# Altium schematic sheet FrameWork.SchDoc: FrameWork.SchDoc
size A3; Author: flotox@yeah.net; Revision: v1.0.0; SheetNumber: 1; SheetTotal: 10
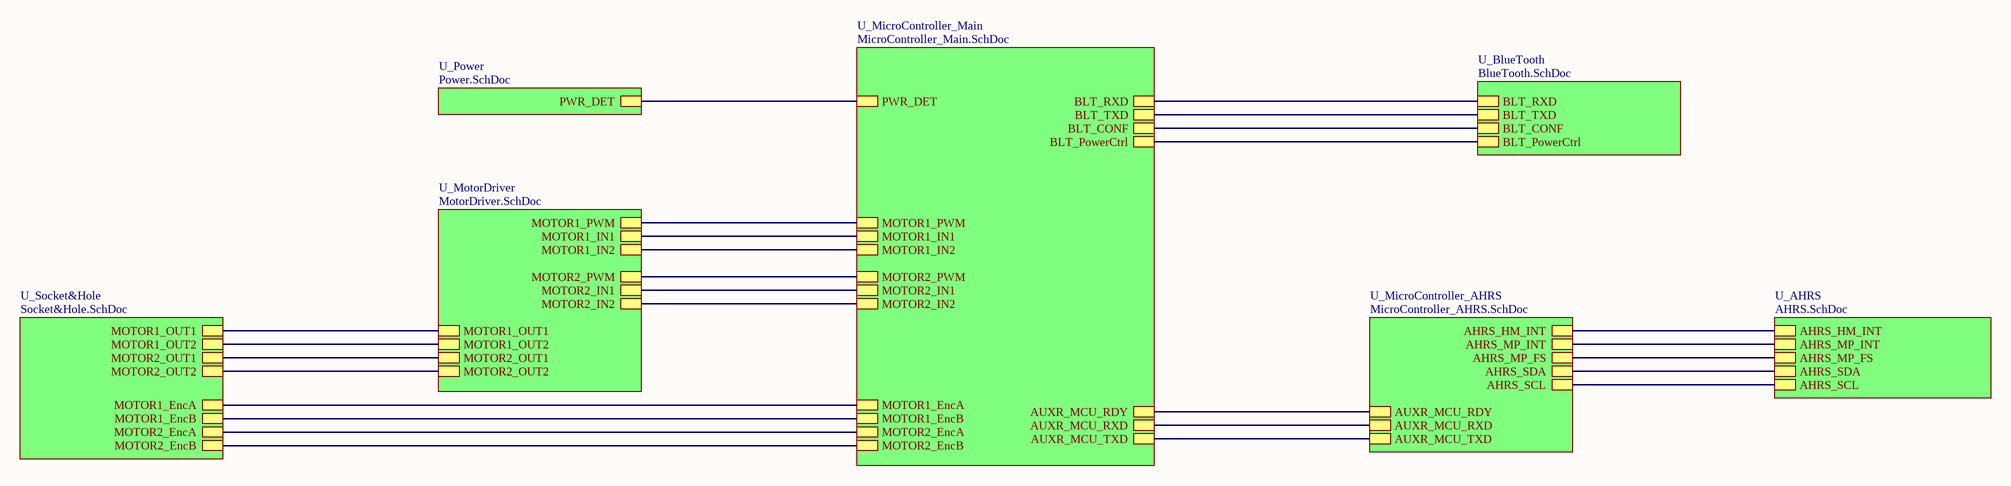
[diagram p0: FrameWork.SchDoc]

## Sub-sheets
U_AHRS = AHRS.SchDoc: AHRS_MP_INT, AHRS_SCL, AHRS_SDA, AHRS_MP_FS, AHRS_HM_INT
U_BlueTooth = BlueTooth.SchDoc: BLT_RXD, BLT_TXD, BLT_CONF, BLT_PowerCtrl
U_MicroController_AHRS = MicroController_AHRS.SchDoc: AUXR_MCU_RDY, AUXR_MCU_TXD, AUXR_MCU_RXD, AHRS_SCL, AHRS_SDA, AHRS_HM_INT, AHRS_MP_INT, AHRS_MP_FS
U_MicroController_Main = MicroController_Main.SchDoc: BLT_RXD, BLT_TXD, BLT_CONF, BLT_PowerCtrl, AUXR_MCU_TXD, AUXR_MCU_RXD, AUXR_MCU_RDY, PWR_DET, MOTOR1_PWM, MOTOR1_IN2, MOTOR1_IN1, MOTOR2_IN1, MOTOR2_IN2, MOTOR2_PWM, MOTOR1_EncA, MOTOR1_EncB, MOTOR2_EncA, MOTOR2_EncB
U_MotorDriver = MotorDriver.SchDoc: MOTOR1_OUT1, MOTOR1_OUT2, MOTOR2_OUT1, MOTOR2_OUT2, MOTOR1_PWM, MOTOR2_PWM, MOTOR1_IN1, MOTOR1_IN2, MOTOR2_IN1, MOTOR2_IN2
U_Power = Power.SchDoc: PWR_DET
U_Socket&Hole = Socket&Hole.SchDoc: MOTOR1_EncA, MOTOR1_EncB, MOTOR2_EncA, MOTOR2_EncB, MOTOR1_OUT1, MOTOR1_OUT2, MOTOR2_OUT1, MOTOR2_OUT2

## Nets
(unnamed): sheet U_MicroController_Main/BLT_RXD, sheet U_BlueTooth/BLT_RXD
(unnamed): sheet U_MicroController_Main/BLT_TXD, sheet U_BlueTooth/BLT_TXD
(unnamed): sheet U_MicroController_Main/BLT_CONF, sheet U_BlueTooth/BLT_CONF
(unnamed): sheet U_MicroController_Main/BLT_PowerCtrl, sheet U_BlueTooth/BLT_PowerCtrl
(unnamed): sheet U_MicroController_Main/AUXR_MCU_TXD, sheet U_MicroController_AHRS/AUXR_MCU_TXD
(unnamed): sheet U_MicroController_Main/AUXR_MCU_RXD, sheet U_MicroController_AHRS/AUXR_MCU_RXD
(unnamed): sheet U_MicroController_Main/AUXR_MCU_RDY, sheet U_MicroController_AHRS/AUXR_MCU_RDY
(unnamed): sheet U_MicroController_Main/PWR_DET, sheet U_Power/PWR_DET
(unnamed): sheet U_MicroController_Main/MOTOR1_PWM, sheet U_MotorDriver/MOTOR1_PWM
(unnamed): sheet U_MicroController_Main/MOTOR1_IN2, sheet U_MotorDriver/MOTOR1_IN2
(unnamed): sheet U_MicroController_Main/MOTOR1_IN1, sheet U_MotorDriver/MOTOR1_IN1
(unnamed): sheet U_MicroController_Main/MOTOR2_IN1, sheet U_MotorDriver/MOTOR2_IN1
(unnamed): sheet U_MicroController_Main/MOTOR2_IN2, sheet U_MotorDriver/MOTOR2_IN2
(unnamed): sheet U_MicroController_Main/MOTOR2_PWM, sheet U_MotorDriver/MOTOR2_PWM
(unnamed): sheet U_MicroController_Main/MOTOR1_EncA, sheet U_Socket&Hole/MOTOR1_EncA
(unnamed): sheet U_MicroController_Main/MOTOR1_EncB, sheet U_Socket&Hole/MOTOR1_EncB
(unnamed): sheet U_MicroController_Main/MOTOR2_EncA, sheet U_Socket&Hole/MOTOR2_EncA
(unnamed): sheet U_MicroController_Main/MOTOR2_EncB, sheet U_Socket&Hole/MOTOR2_EncB
(unnamed): sheet U_Socket&Hole/MOTOR1_OUT1, sheet U_MotorDriver/MOTOR1_OUT1
(unnamed): sheet U_Socket&Hole/MOTOR1_OUT2, sheet U_MotorDriver/MOTOR1_OUT2
(unnamed): sheet U_Socket&Hole/MOTOR2_OUT1, sheet U_MotorDriver/MOTOR2_OUT1
(unnamed): sheet U_Socket&Hole/MOTOR2_OUT2, sheet U_MotorDriver/MOTOR2_OUT2
(unnamed): sheet U_MicroController_AHRS/AHRS_SCL, sheet U_AHRS/AHRS_SCL
(unnamed): sheet U_MicroController_AHRS/AHRS_SDA, sheet U_AHRS/AHRS_SDA
(unnamed): sheet U_MicroController_AHRS/AHRS_HM_INT, sheet U_AHRS/AHRS_HM_INT
(unnamed): sheet U_MicroController_AHRS/AHRS_MP_INT, sheet U_AHRS/AHRS_MP_INT
(unnamed): sheet U_MicroController_AHRS/AHRS_MP_FS, sheet U_AHRS/AHRS_MP_FS

## Notes on the sheet
- Title
- Revision:
- Number:
- Author:
- Check By:
- Sheet
- of
- Size:
- A3
- Date: